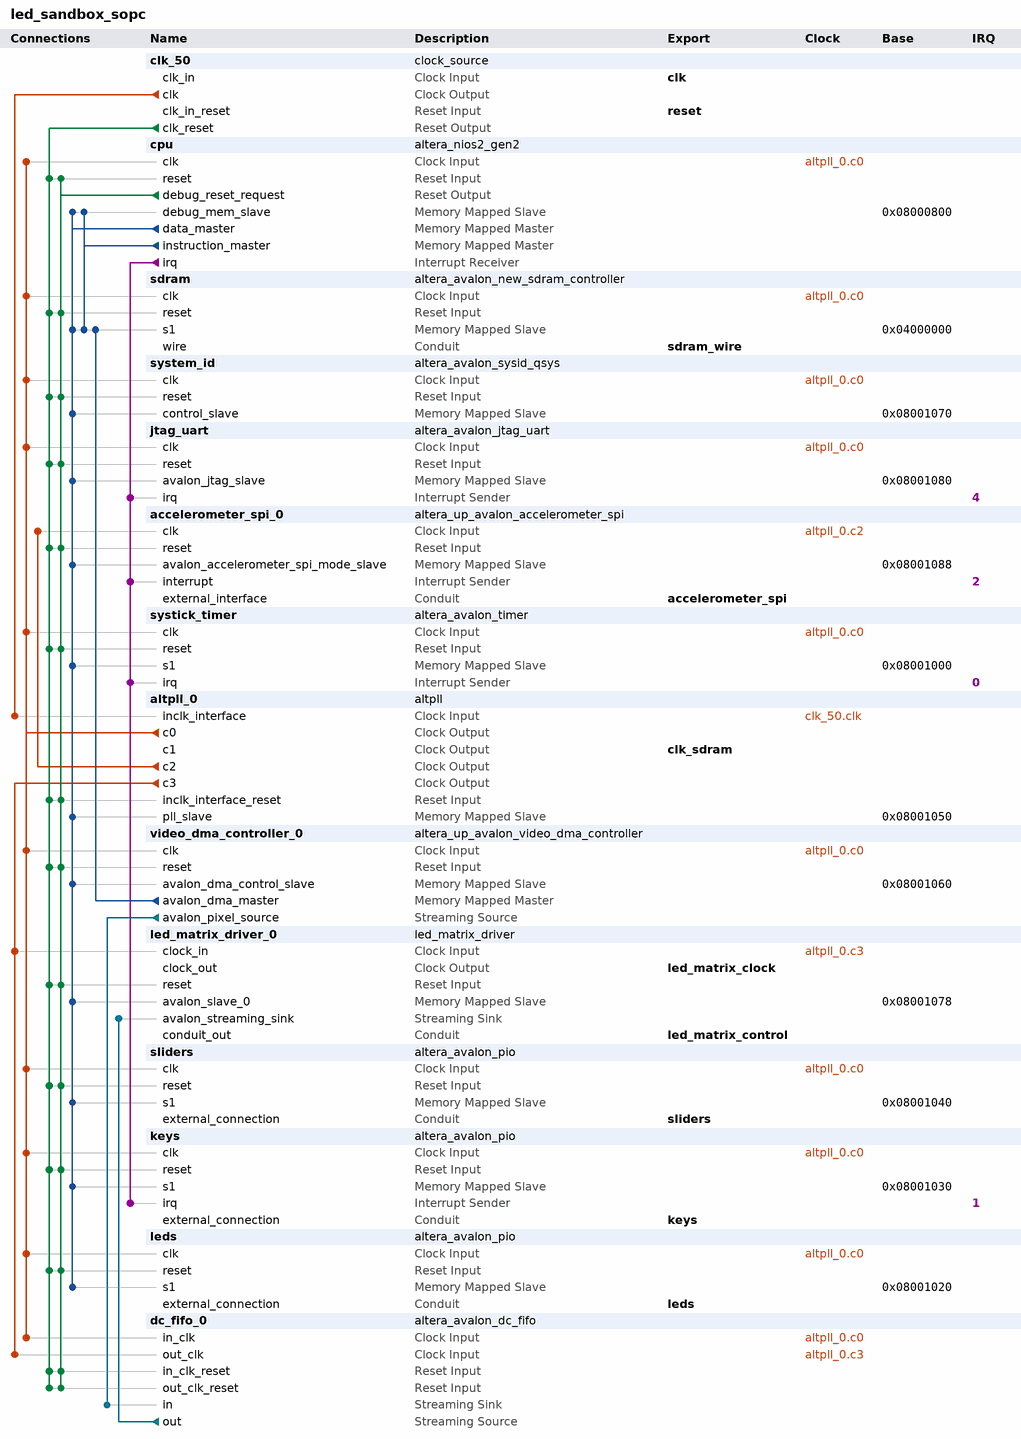
[diagram p0: system contents]
# Platform Designer (Qsys) system led_sandbox_sopc, MAX 10 10M50DAF484C7G
# Parameters at their usual value, and those the tool derives, are not listed.
package require -exact qsys 18.1
create_system led_sandbox_sopc
set_project_property DEVICE_FAMILY {MAX 10}
set_project_property DEVICE 10M50DAF484C7G

add_instance clk_50 clock_source 18.1
set_instance_parameter_value clk_50 clockFrequency 50000000

add_instance cpu altera_nios2_gen2 18.1
set_instance_parameter_value cpu dcache_size 2048
set_instance_parameter_value cpu exceptionSlave sdram.s1
set_instance_parameter_value cpu icache_size 4096
set_instance_parameter_value cpu impl Fast
set_instance_parameter_value cpu resetSlave sdram.s1

add_instance sdram altera_avalon_new_sdram_controller 18.1
set_instance_parameter_value sdram TAC 5.5
set_instance_parameter_value sdram TRCD 20.0
set_instance_parameter_value sdram TRP 20.0
set_instance_parameter_value sdram casLatency 3
set_instance_parameter_value sdram columnWidth 10
set_instance_parameter_value sdram dataWidth 16
set_instance_parameter_value sdram generateSimulationModel true
set_instance_parameter_value sdram model single_Micron_MT48LC4M32B2_7_chip
set_instance_parameter_value sdram numberOfBanks 4
set_instance_parameter_value sdram numberOfChipSelects 1
set_instance_parameter_value sdram powerUpDelay 100.0
set_instance_parameter_value sdram refreshPeriod 15.625
set_instance_parameter_value sdram rowWidth 13

add_instance system_id altera_avalon_sysid_qsys 18.1
set_instance_parameter_value system_id id 3

add_instance jtag_uart altera_avalon_jtag_uart 18.1
set_instance_parameter_value jtag_uart simInteractiveOptions NO_INTERACTIVE_WINDOWS

add_instance accelerometer_spi_0 altera_up_avalon_accelerometer_spi 18.0

add_instance systick_timer altera_avalon_timer 18.1
set_instance_parameter_value systick_timer period 1
set_instance_parameter_value systick_timer periodUnits MSEC

add_instance altpll_0 altpll 18.1
set_instance_parameter_value altpll_0 CLK0_DIVIDE_BY 1
set_instance_parameter_value altpll_0 CLK0_MULTIPLY_BY 2
set_instance_parameter_value altpll_0 CLK1_DIVIDE_BY 1
set_instance_parameter_value altpll_0 CLK1_DUTY_CYCLE 50
set_instance_parameter_value altpll_0 CLK1_MULTIPLY_BY 2
set_instance_parameter_value altpll_0 CLK1_PHASE_SHIFT -3000
set_instance_parameter_value altpll_0 CLK2_DIVIDE_BY 25
set_instance_parameter_value altpll_0 CLK2_DUTY_CYCLE 50
set_instance_parameter_value altpll_0 CLK2_MULTIPLY_BY 1
set_instance_parameter_value altpll_0 CLK2_PHASE_SHIFT 0
set_instance_parameter_value altpll_0 CLK3_DIVIDE_BY 125
set_instance_parameter_value altpll_0 CLK3_DUTY_CYCLE 50
set_instance_parameter_value altpll_0 CLK3_MULTIPLY_BY 1
set_instance_parameter_value altpll_0 CLK3_PHASE_SHIFT 0
set_instance_parameter_value altpll_0 INCLK0_INPUT_FREQUENCY 20000
set_instance_parameter_value altpll_0 PORT_ARESET PORT_UNUSED
set_instance_parameter_value altpll_0 PORT_LOCKED PORT_UNUSED
set_instance_parameter_value altpll_0 PORT_clk1 PORT_USED
set_instance_parameter_value altpll_0 PORT_clk2 PORT_USED
set_instance_parameter_value altpll_0 PORT_clk3 PORT_USED

add_instance video_dma_controller_0 altera_up_avalon_video_dma_controller 18.0
set_instance_parameter_value video_dma_controller_0 addr_mode Consecutive
set_instance_parameter_value video_dma_controller_0 back_start_address 0
set_instance_parameter_value video_dma_controller_0 color_bits 8
set_instance_parameter_value video_dma_controller_0 color_planes 1
set_instance_parameter_value video_dma_controller_0 dma_enabled true
set_instance_parameter_value video_dma_controller_0 height 16
set_instance_parameter_value video_dma_controller_0 mode {From Memory to Stream}
set_instance_parameter_value video_dma_controller_0 start_address 0
set_instance_parameter_value video_dma_controller_0 width 64

add_instance led_matrix_driver_0 led_matrix_driver 1.0
set_instance_parameter_value led_matrix_driver_0 ENABLE_DEFAULT 1
set_instance_parameter_value led_matrix_driver_0 MAT_HEIGHT 32
set_instance_parameter_value led_matrix_driver_0 MAT_WIDTH 64
set_instance_parameter_value led_matrix_driver_0 RESET_DEFAULT 0

add_instance sliders altera_avalon_pio 18.1
set_instance_parameter_value sliders direction Input
set_instance_parameter_value sliders width 10

add_instance keys altera_avalon_pio 18.1
set_instance_parameter_value keys bitClearingEdgeCapReg true
set_instance_parameter_value keys captureEdge true
set_instance_parameter_value keys direction Input
set_instance_parameter_value keys edgeType FALLING
set_instance_parameter_value keys generateIRQ true
set_instance_parameter_value keys irqType EDGE
set_instance_parameter_value keys width 2

add_instance leds altera_avalon_pio 18.1
set_instance_parameter_value leds direction Output
set_instance_parameter_value leds width 10

add_instance dc_fifo_0 altera_avalon_dc_fifo 18.1
set_instance_parameter_value dc_fifo_0 BITS_PER_SYMBOL 8
set_instance_parameter_value dc_fifo_0 FIFO_DEPTH 64
set_instance_parameter_value dc_fifo_0 USE_PACKETS 1

# connections
add_connection altpll_0.c0 cpu.clk clock
add_connection altpll_0.c0 dc_fifo_0.in_clk clock
add_connection altpll_0.c0 jtag_uart.clk clock
add_connection altpll_0.c0 keys.clk clock
add_connection altpll_0.c0 leds.clk clock
add_connection altpll_0.c0 sdram.clk clock
add_connection altpll_0.c0 sliders.clk clock
add_connection altpll_0.c0 system_id.clk clock
add_connection altpll_0.c0 systick_timer.clk clock
add_connection altpll_0.c0 video_dma_controller_0.clk clock
add_connection altpll_0.c2 accelerometer_spi_0.clk clock
add_connection altpll_0.c3 dc_fifo_0.out_clk clock
add_connection altpll_0.c3 led_matrix_driver_0.clock_in clock
add_connection clk_50.clk altpll_0.inclk_interface clock
add_connection clk_50.clk_reset accelerometer_spi_0.reset reset
add_connection clk_50.clk_reset altpll_0.inclk_interface_reset reset
add_connection clk_50.clk_reset cpu.reset reset
add_connection clk_50.clk_reset dc_fifo_0.in_clk_reset reset
add_connection clk_50.clk_reset dc_fifo_0.out_clk_reset reset
add_connection clk_50.clk_reset jtag_uart.reset reset
add_connection clk_50.clk_reset keys.reset reset
add_connection clk_50.clk_reset led_matrix_driver_0.reset reset
add_connection clk_50.clk_reset leds.reset reset
add_connection clk_50.clk_reset sdram.reset reset
add_connection clk_50.clk_reset sliders.reset reset
add_connection clk_50.clk_reset system_id.reset reset
add_connection clk_50.clk_reset systick_timer.reset reset
add_connection clk_50.clk_reset video_dma_controller_0.reset reset
add_connection cpu.debug_reset_request accelerometer_spi_0.reset reset
add_connection cpu.debug_reset_request altpll_0.inclk_interface_reset reset
add_connection cpu.debug_reset_request cpu.reset reset
add_connection cpu.debug_reset_request dc_fifo_0.in_clk_reset reset
add_connection cpu.debug_reset_request dc_fifo_0.out_clk_reset reset
add_connection cpu.debug_reset_request jtag_uart.reset reset
add_connection cpu.debug_reset_request keys.reset reset
add_connection cpu.debug_reset_request led_matrix_driver_0.reset reset
add_connection cpu.debug_reset_request leds.reset reset
add_connection cpu.debug_reset_request sdram.reset reset
add_connection cpu.debug_reset_request sliders.reset reset
add_connection cpu.debug_reset_request system_id.reset reset
add_connection cpu.debug_reset_request systick_timer.reset reset
add_connection cpu.debug_reset_request video_dma_controller_0.reset reset
add_connection cpu.data_master accelerometer_spi_0.avalon_accelerometer_spi_mode_slave avalon
set_connection_parameter_value cpu.data_master/accelerometer_spi_0.avalon_accelerometer_spi_mode_slave baseAddress 0x08001088
add_connection cpu.data_master altpll_0.pll_slave avalon
set_connection_parameter_value cpu.data_master/altpll_0.pll_slave baseAddress 0x08001050
add_connection cpu.data_master cpu.debug_mem_slave avalon
set_connection_parameter_value cpu.data_master/cpu.debug_mem_slave baseAddress 0x08000800
add_connection cpu.data_master jtag_uart.avalon_jtag_slave avalon
set_connection_parameter_value cpu.data_master/jtag_uart.avalon_jtag_slave baseAddress 0x08001080
add_connection cpu.data_master keys.s1 avalon
set_connection_parameter_value cpu.data_master/keys.s1 baseAddress 0x08001030
add_connection cpu.data_master led_matrix_driver_0.avalon_slave_0 avalon
set_connection_parameter_value cpu.data_master/led_matrix_driver_0.avalon_slave_0 baseAddress 0x08001078
add_connection cpu.data_master leds.s1 avalon
set_connection_parameter_value cpu.data_master/leds.s1 baseAddress 0x08001020
add_connection cpu.data_master sdram.s1 avalon
set_connection_parameter_value cpu.data_master/sdram.s1 baseAddress 0x04000000
add_connection cpu.data_master sliders.s1 avalon
set_connection_parameter_value cpu.data_master/sliders.s1 baseAddress 0x08001040
add_connection cpu.data_master system_id.control_slave avalon
set_connection_parameter_value cpu.data_master/system_id.control_slave baseAddress 0x08001070
add_connection cpu.data_master systick_timer.s1 avalon
set_connection_parameter_value cpu.data_master/systick_timer.s1 baseAddress 0x08001000
add_connection cpu.data_master video_dma_controller_0.avalon_dma_control_slave avalon
set_connection_parameter_value cpu.data_master/video_dma_controller_0.avalon_dma_control_slave baseAddress 0x08001060
add_connection cpu.instruction_master cpu.debug_mem_slave avalon
set_connection_parameter_value cpu.instruction_master/cpu.debug_mem_slave baseAddress 0x08000800
add_connection cpu.instruction_master sdram.s1 avalon
set_connection_parameter_value cpu.instruction_master/sdram.s1 baseAddress 0x04000000
add_connection video_dma_controller_0.avalon_dma_master sdram.s1 avalon
set_connection_parameter_value video_dma_controller_0.avalon_dma_master/sdram.s1 baseAddress 0x04000000
add_connection dc_fifo_0.out led_matrix_driver_0.avalon_streaming_sink avalon_streaming
add_connection video_dma_controller_0.avalon_pixel_source dc_fifo_0.in avalon_streaming
add_connection cpu.irq accelerometer_spi_0.interrupt interrupt
set_connection_parameter_value cpu.irq/accelerometer_spi_0.interrupt irqNumber 2
add_connection cpu.irq jtag_uart.irq interrupt
set_connection_parameter_value cpu.irq/jtag_uart.irq irqNumber 4
add_connection cpu.irq keys.irq interrupt
set_connection_parameter_value cpu.irq/keys.irq irqNumber 1
add_connection cpu.irq systick_timer.irq interrupt
set_connection_parameter_value cpu.irq/systick_timer.irq irqNumber 0

# exported interfaces
add_interface accelerometer_spi conduit end
set_interface_property accelerometer_spi EXPORT_OF accelerometer_spi_0.external_interface
add_interface clk clock sink
set_interface_property clk EXPORT_OF clk_50.clk_in
add_interface clk_sdram clock source
set_interface_property clk_sdram EXPORT_OF altpll_0.c1
add_interface keys conduit end
set_interface_property keys EXPORT_OF keys.external_connection
add_interface led_matrix_clock clock source
set_interface_property led_matrix_clock EXPORT_OF led_matrix_driver_0.clock_out
add_interface led_matrix_control conduit end
set_interface_property led_matrix_control EXPORT_OF led_matrix_driver_0.conduit_out
add_interface leds conduit end
set_interface_property leds EXPORT_OF leds.external_connection
add_interface reset reset sink
set_interface_property reset EXPORT_OF clk_50.clk_in_reset
add_interface sdram_wire conduit end
set_interface_property sdram_wire EXPORT_OF sdram.wire
add_interface sliders conduit end
set_interface_property sliders EXPORT_OF sliders.external_connection

set_interconnect_requirement {$system} qsys_mm.clockCrossingAdapter HANDSHAKE
set_interconnect_requirement {$system} qsys_mm.enableEccProtection FALSE
set_interconnect_requirement {$system} qsys_mm.insertDefaultSlave FALSE
set_interconnect_requirement {$system} qsys_mm.maxAdditionalLatency 1

save_system led_sandbox_sopc.qsys
